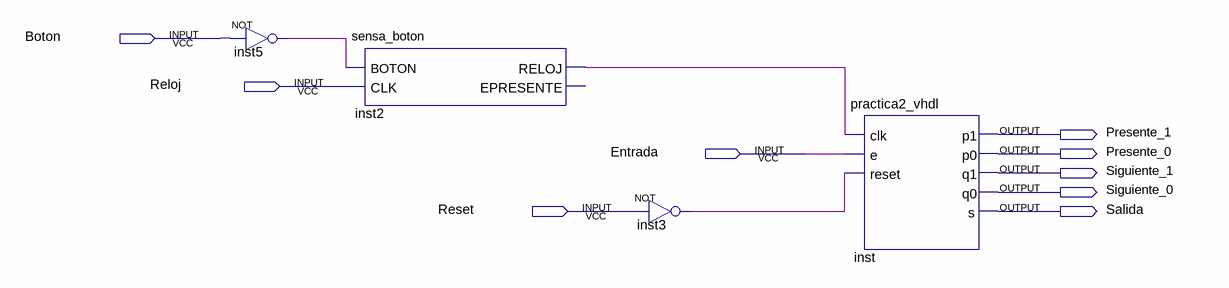
[diagram p0: schematic sheet]
// Quartus schematic practica2.bdf as structural Verilog: 4 symbols, 9 pins
module practica2 (
  input  Boton,
  input  Reloj,
  input  Entrada,
  input  Reset,
  output Presente_1,
  output Presente_0,
  output Siguiente_1,
  output Siguiente_0,
  output Salida
);

  wire inst2_reloj, inst3_out, inst5_out;

  not inst5 (inst5_out, Boton);
  sensa_boton inst2 (.BOTON(inst5_out), .CLK(Reloj), .RELOJ(inst2_reloj));  // open: EPRESENTE
  not inst3 (inst3_out, Reset);
  practica2_vhdl inst (
    .clk(inst2_reloj), .e(Entrada), .reset(inst3_out), .p1(Presente_1), .p0(Presente_0), .q1(Siguiente_1),
    .q0(Siguiente_0), .s(Salida));
endmodule
